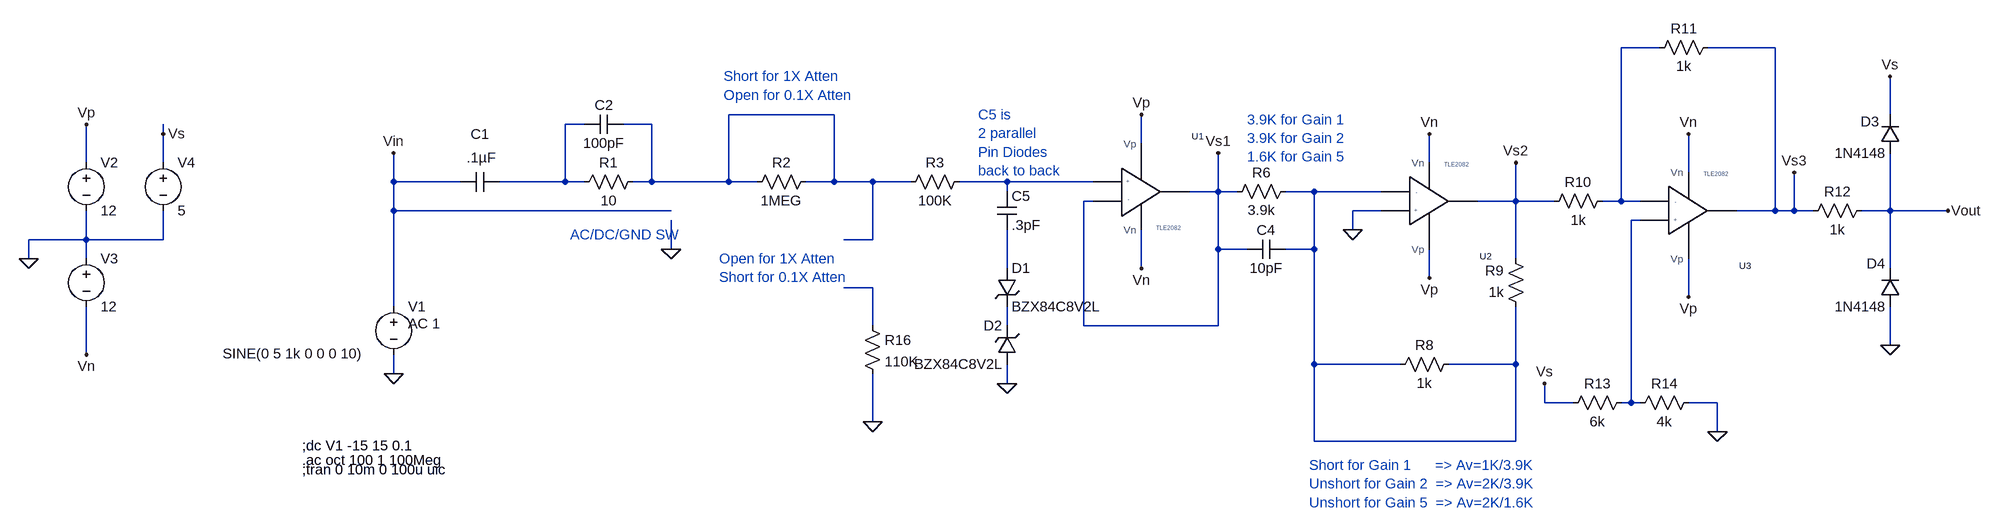
[diagram p0: schematic Analog_Frontend_TLE208.asc]
Analog_Frontend_TLE208.asc, the LTspice schematic file:
Version 4
SHEET 1 2208 680
WIRE 1120 -112 1056 -112
WIRE 1312 -112 1200 -112
WIRE -256 0 -432 0
WIRE 1504 0 1504 -64
WIRE -672 16 -704 16
WIRE -560 16 -608 16
WIRE -1376 32 -1376 16
WIRE 256 48 256 0
WIRE -1504 80 -1504 16
WIRE -1376 80 -1376 32
WIRE 736 80 736 32
WIRE 1168 96 1168 32
WIRE -992 112 -992 64
WIRE -880 112 -992 112
WIRE -704 112 -704 16
WIRE -704 112 -816 112
WIRE -672 112 -704 112
WIRE -560 112 -560 16
WIRE -560 112 -592 112
WIRE -432 112 -432 0
WIRE -432 112 -560 112
WIRE -384 112 -432 112
WIRE -256 112 -256 0
WIRE -256 112 -304 112
WIRE -192 112 -256 112
WIRE -128 112 -192 112
WIRE 32 112 -48 112
WIRE 176 112 32 112
WIRE 32 128 32 112
WIRE 384 128 384 64
WIRE 384 128 336 128
WIRE 416 128 384 128
WIRE 544 128 496 128
WIRE 656 128 544 128
WIRE 176 144 160 144
WIRE 880 144 880 80
WIRE 880 144 816 144
WIRE 944 144 880 144
WIRE 1056 144 1056 -112
WIRE 1056 144 1024 144
WIRE 1088 144 1056 144
WIRE -992 160 -992 112
WIRE -528 160 -992 160
WIRE 656 160 608 160
WIRE 1312 160 1312 -112
WIRE 1312 160 1248 160
WIRE 1344 160 1344 96
WIRE 1344 160 1312 160
WIRE 1376 160 1344 160
WIRE 1504 160 1504 64
WIRE 1504 160 1456 160
WIRE 1600 160 1504 160
WIRE 1088 176 1072 176
WIRE 608 192 608 160
WIRE -1504 208 -1504 160
WIRE -1504 208 -1600 208
WIRE -1376 208 -1376 160
WIRE -1376 208 -1504 208
WIRE -192 208 -192 112
WIRE -192 208 -240 208
WIRE -528 224 -528 176
WIRE 384 224 384 128
WIRE 432 224 384 224
WIRE 544 224 544 128
WIRE 544 224 496 224
WIRE -1600 240 -1600 208
WIRE -1504 240 -1504 208
WIRE 880 240 880 144
WIRE 32 256 32 192
WIRE 256 256 256 192
WIRE 1504 256 1504 160
WIRE 736 272 736 224
WIRE -192 288 -240 288
WIRE 1168 304 1168 240
WIRE -992 320 -992 160
WIRE -192 352 -192 288
WIRE 32 352 32 320
WIRE 160 352 160 144
WIRE 384 352 384 224
WIRE 384 352 160 352
WIRE 1504 384 1504 320
WIRE -1504 400 -1504 320
WIRE 544 416 544 224
WIRE 688 416 544 416
WIRE 880 416 880 320
WIRE 880 416 768 416
WIRE -992 432 -992 400
WIRE 32 448 32 416
WIRE 928 480 928 448
WIRE 976 480 928 480
WIRE 1072 480 1072 176
WIRE 1072 480 1056 480
WIRE 1088 480 1072 480
WIRE 1216 480 1168 480
WIRE -192 512 -192 432
WIRE 1216 528 1216 480
WIRE 544 544 544 416
WIRE 880 544 880 416
WIRE 880 544 544 544
FLAG -992 432 0
FLAG -1600 240 0
FLAG -1504 16 Vp
FLAG -1504 400 Vn
FLAG 256 0 Vp
FLAG 256 256 Vn
FLAG 736 32 Vn
FLAG 736 272 Vp
FLAG 608 192 0
FLAG 1168 32 Vn
FLAG 1168 304 Vp
FLAG -992 64 Vin
FLAG 384 64 Vs1
FLAG 880 80 Vs2
FLAG 1344 96 Vs3
FLAG 1600 160 Vout
FLAG 1504 384 0
FLAG -1376 32 Vs
FLAG 1504 -64 Vs
FLAG 1216 528 0
FLAG 928 448 Vs
FLAG -192 512 0
FLAG -528 224 0
FLAG 32 448 0
SYMBOL TLE2082 224 160 R0
SYMATTR InstName U1
SYMBOL res -576 96 R90
WINDOW 0 0 56 VBottom 2
WINDOW 3 32 56 VTop 2
SYMATTR InstName R1
SYMATTR Value 10
SYMBOL voltage -992 304 R0
WINDOW 3 -285 94 Left 2
WINDOW 123 24 44 Left 2
WINDOW 39 0 0 Left 2
SYMATTR Value SINE(0 5 1k 0 0 0 10)
SYMATTR Value2 AC 1
SYMATTR InstName V1
SYMBOL voltage -1504 64 R0
WINDOW 123 0 0 Left 2
WINDOW 39 0 0 Left 2
SYMATTR InstName V2
SYMATTR Value 12
SYMBOL voltage -1504 224 R0
WINDOW 123 0 0 Left 2
WINDOW 39 0 0 Left 2
SYMATTR InstName V3
SYMATTR Value 12
SYMBOL cap -816 96 R90
WINDOW 0 -48 32 VBottom 2
WINDOW 3 -40 30 VTop 2
SYMATTR InstName C1
SYMATTR Value .1µF
SYMBOL res 512 112 R90
WINDOW 0 0 56 VBottom 2
WINDOW 3 32 56 VTop 2
SYMATTR InstName R6
SYMATTR Value 3.9k
SYMBOL TLE2082 704 112 M180
SYMATTR InstName U2
SYMBOL res 784 400 R90
WINDOW 0 0 56 VBottom 2
WINDOW 3 32 56 VTop 2
SYMATTR InstName R8
SYMATTR Value 1k
SYMBOL res 896 336 R180
WINDOW 0 36 76 Left 2
WINDOW 3 36 40 Left 2
SYMATTR InstName R9
SYMATTR Value 1k
SYMBOL res 1040 128 R90
WINDOW 0 0 56 VBottom 2
WINDOW 3 32 56 VTop 2
SYMATTR InstName R10
SYMATTR Value 1k
SYMBOL TLE2082 1136 128 M180
SYMATTR InstName U3
SYMBOL res 1216 -128 R90
WINDOW 0 0 56 VBottom 2
WINDOW 3 32 56 VTop 2
SYMATTR InstName R11
SYMATTR Value 1k
SYMBOL res 1472 144 R90
WINDOW 0 0 56 VBottom 2
WINDOW 3 32 56 VTop 2
SYMATTR InstName R12
SYMATTR Value 1k
SYMBOL diode 1520 64 R180
WINDOW 0 34 52 Left 2
WINDOW 3 24 0 Left 2
SYMATTR InstName D3
SYMATTR Value 1N4148
SYMBOL diode 1520 320 R180
WINDOW 0 24 72 Left 2
WINDOW 3 24 0 Left 2
SYMATTR InstName D4
SYMATTR Value 1N4148
SYMBOL voltage -1376 64 R0
WINDOW 123 0 0 Left 2
WINDOW 39 0 0 Left 2
SYMATTR InstName V4
SYMATTR Value 5
SYMBOL res 1072 464 R90
WINDOW 0 0 56 VBottom 2
WINDOW 3 32 56 VTop 2
SYMATTR InstName R13
SYMATTR Value 6k
SYMBOL res 1184 464 R90
WINDOW 0 0 56 VBottom 2
WINDOW 3 32 56 VTop 2
SYMATTR InstName R14
SYMATTR Value 4k
SYMATTR SpiceLine tol=1 pwr=0.1
SYMBOL res -208 336 R0
SYMATTR InstName R16
SYMATTR Value 110K
SYMBOL cap -608 0 R90
WINDOW 0 0 32 VBottom 2
WINDOW 3 32 32 VTop 2
SYMATTR InstName C2
SYMATTR Value 100pF
SYMBOL res -288 96 R90
WINDOW 0 0 56 VBottom 2
WINDOW 3 32 56 VTop 2
SYMATTR InstName R2
SYMATTR Value 1MEG
SYMBOL cap 496 208 R90
WINDOW 0 0 32 VBottom 2
WINDOW 3 32 32 VTop 2
SYMATTR InstName C4
SYMATTR Value 10pF
SYMBOL res -32 96 R90
WINDOW 0 0 56 VBottom 2
WINDOW 3 32 56 VTop 2
SYMATTR InstName R3
SYMATTR Value 100K
SYMBOL zener 16 256 R0
SYMATTR InstName D1
SYMATTR Value BZX84C8V2L
SYMATTR Description Diode
SYMATTR Type diode
SYMBOL zener 48 416 R180
WINDOW 0 24 64 Left 2
WINDOW 3 24 0 Left 2
SYMATTR InstName D2
SYMATTR Value BZX84C8V2L
SYMATTR Description Diode
SYMATTR Type diode
SYMBOL cap 16 128 R0
SYMATTR InstName C5
SYMATTR Value .3pF
TEXT -1144 552 Left 2 !;dc V1 -15 15 0.1
TEXT -1144 576 Left 2 !.ac oct 100 1 100Meg
TEXT -1144 592 Left 2 !;tran 0 10m 0 100u uic
TEXT -696 200 Left 2 ;AC/DC/GND SW
TEXT 536 584 Left 2 ;Short for Gain 1      => Av=1K/3.9K\nUnshort for Gain 2  => Av=2K/3.9K\nUnshort for Gain 5  => Av=2K/1.6K
TEXT 432 8 Left 2 ;3.9K for Gain 1\n3.9K for Gain 2\n1.6K for Gain 5
TEXT -440 -64 Left 2 ;Short for 1X Atten\nOpen for 0.1X Atten
TEXT -448 240 Left 2 ;Open for 1X Atten\nShort for 0.1X Atten
TEXT -16 0 Left 2 ;C5 is\n2 parallel\nPin Diodes\nback to back

The netlist it stands for:
* Analog_Frontend_TLE208.asc
XU1 N004 Vs1 Vp Vn Vs1 TLE2082 TLE2082  ; pins + - Vp Vn O
R1 N002 N003 10
V1 Vin 0 SINE(0 5 1k 0 0 0 10) AC 1
V2 Vp 0 12
V3 0 Vn 12
C1 N003 Vin .1µF
R6 N005 Vs1 3.9k
XU2 0 N005 Vp Vn Vs2 TLE2082 TLE2082  ; pins + - Vp Vn O
R8 N005 N005 1k
R9 N005 Vs2 1k
R10 N001 Vs2 1k
XU3 N006 N001 Vp Vn Vs3 TLE2082 TLE2082  ; pins + - Vp Vn O
R11 Vs3 N001 1k
R12 Vout Vs3 1k
D3 Vout Vs 1N4148
D4 0 Vout 1N4148
V4 Vs 0 5
R13 N006 Vs 6k
R14 0 N006 4k tol=1 pwr=0.1
R16 N008 0 110K
C2 N002 N003 100pF
R2 N002 N002 1MEG
C4 N005 Vs1 10pF
R3 N004 N002 100K
D1 N007 N009 BZX84C8V2L
D2 0 N009 BZX84C8V2L
C5 N004 N007 .3pF
.model D D
.lib standard.dio
;dc V1 -15 15 0.1
.ac oct 100 1 100Meg
;tran 0 10m 0 100u uic
* AC/DC/GND SW
* Short for Gain 1      => Av=1K/3.9K
* Unshort for Gain 2  => Av=2K/3.9K
* Unshort for Gain 5  => Av=2K/1.6K
* 3.9K for Gain 1
* 3.9K for Gain 2
* 1.6K for Gain 5
* Short for 1X Atten
* Open for 0.1X Atten
* Open for 1X Atten
* Short for 0.1X Atten
* C5 is
* 2 parallel
* Pin Diodes
* back to back
.lib TLE2082.cir
.backanno
.end